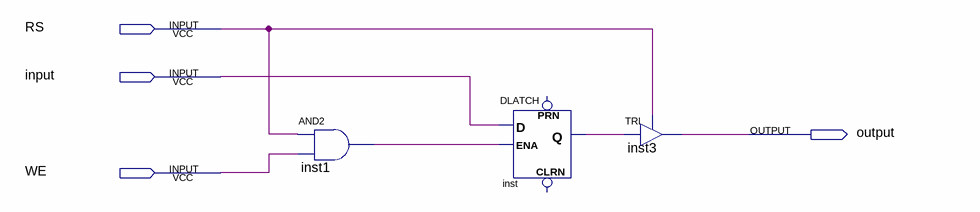
[diagram p0: schematic sheet]
// Quartus schematic MC.bdf as structural Verilog: 3 symbols, 4 pins
module MC (
  input  RS,
  input  \input ,
  input  WE,
  output \output 
);

  wire inst1_out, inst_q;

  and inst1 (inst1_out, RS, WE);
  DLATCH inst (.D(\input ), .ENA(inst1_out), .Q(inst_q));  // open: CLRN, PRN
  TRI inst3 (.IN(inst_q), .OE(RS), .OUT(\output ));
endmodule
